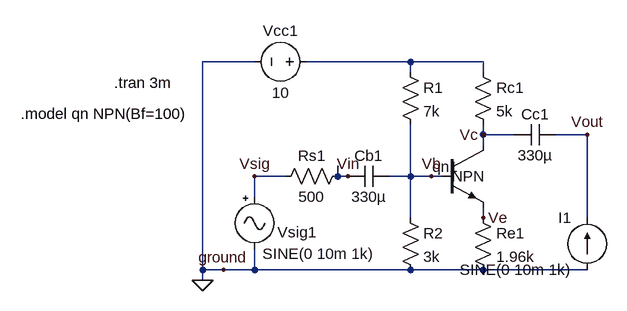
[diagram p0: schematic Draft3.asc]
Draft3.asc, the LTspice schematic file:
Version 4
SHEET 1 880 680
WIRE 16 48 -64 48
WIRE 256 48 96 48
WIRE 368 48 256 48
WIRE 256 64 256 48
WIRE 368 64 368 48
WIRE 368 160 368 144
WIRE 416 160 368 160
WIRE 528 160 480 160
WIRE 368 176 368 160
WIRE 64 224 16 224
WIRE 144 224 144 208
WIRE 160 224 144 224
WIRE 256 224 256 144
WIRE 256 224 224 224
WIRE 288 224 256 224
WIRE 304 224 288 224
WIRE 16 256 16 224
WIRE 256 288 256 224
WIRE 368 288 368 272
WIRE 528 288 528 160
WIRE -64 368 -64 48
WIRE -32 368 -64 368
WIRE 16 368 16 336
WIRE 16 368 -32 368
WIRE 256 368 16 368
WIRE 368 368 256 368
WIRE 528 368 368 368
WIRE -64 384 -64 368
FLAG -32 368 ground
FLAG -64 384 0
FLAG 368 288 Ve
FLAG 288 224 Vb
FLAG 528 160 Vout
FLAG 160 224 Vin
FLAG 16 224 Vsig
FLAG 368 160 Vc
SYMBOL voltage 112 48 R90
WINDOW 0 -32 56 VBottom 2
WINDOW 3 32 56 VTop 2
SYMATTR InstName Vcc1
SYMATTR Value 10
SYMBOL res 352 48 R0
SYMATTR InstName Rc1
SYMATTR Value 5k
SYMBOL res 240 48 R0
SYMATTR InstName R1
SYMATTR Value 7k
SYMBOL cap 480 144 R90
WINDOW 0 0 32 VBottom 2
WINDOW 3 32 32 VTop 2
SYMATTR InstName Cc1
SYMATTR Value 330µ
SYMBOL cap 224 208 R90
WINDOW 0 0 32 VBottom 2
WINDOW 3 32 32 VTop 2
SYMATTR InstName Cb1
SYMATTR Value 330µ
SYMBOL res 48 240 R270
WINDOW 0 32 56 VTop 2
WINDOW 3 0 56 VBottom 2
SYMATTR InstName Rs1
SYMATTR Value 500
SYMBOL res 240 272 R0
SYMATTR InstName R2
SYMATTR Value 3k
SYMBOL res 352 272 R0
SYMATTR InstName Re1
SYMATTR Value 1.96k
SYMBOL npn 304 176 R0
WINDOW 0 -14 33 Left 2
WINDOW 3 16 48 Left 2
SYMATTR InstName qn1
SYMBOL signal 16 240 R0
WINDOW 0 35 70 Left 2
WINDOW 3 12 103 Left 2
WINDOW 123 0 0 Left 2
WINDOW 39 0 0 Left 2
SYMATTR InstName Vsig1
SYMATTR Value SINE(0 10m 1k)
SYMBOL current 528 368 R180
WINDOW 0 24 80 Left 2
WINDOW 3 24 0 Left 2
SYMATTR InstName I1
SYMATTR Value SINE(0 10m 1k)
TEXT -344 128 Left 2 !.model qn NPN(Bf=100)
TEXT -200 80 Left 2 !.tran 3m

The netlist it stands for:
* Draft3.asc
Vcc1 N001 0 10
Rc1 N001 Vc 5k
R1 N001 Vb 7k
Cc1 Vout Vc 330µ
Cb1 Vb Vin 330µ
Rs1 Vsig Vin 500
R2 Vb 0 3k
Re1 Ve 0 1.96k
qn1 Vc Vb Ve 0 NPN
Vsig1 Vsig 0 SINE(0 10m 1k)
I1 0 Vout SINE(0 10m 1k)
.model NPN NPN
.model PNP PNP
.lib standard.bjt
.model qn NPN(Bf=100)
.tran 3m
.backanno
.end